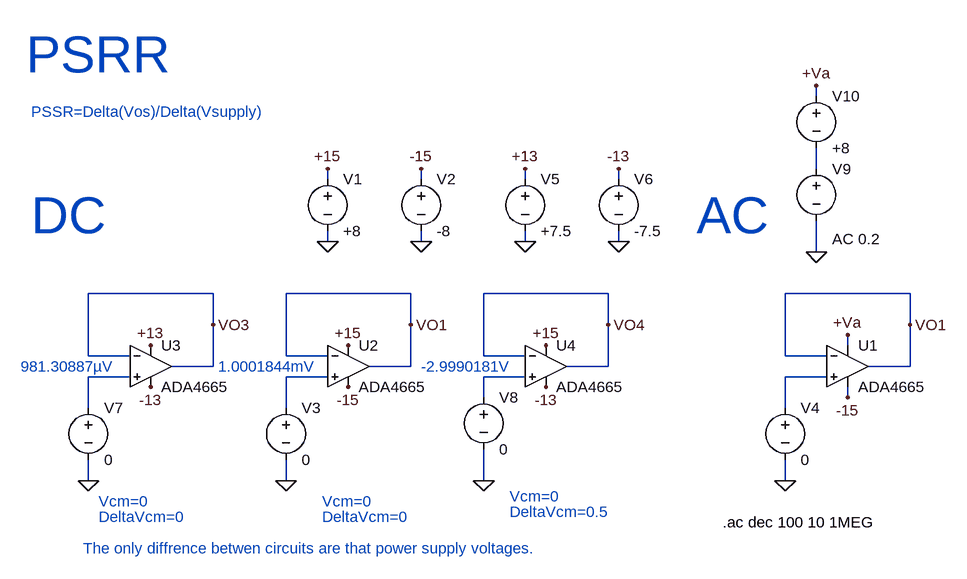
[diagram p0: schematic PSSR.asc]
PSSR.asc, the LTspice schematic file:
Version 4
SHEET 1 1664 680
WIRE 704 -80 704 -96
WIRE 704 32 704 0
WIRE -48 48 -48 32
WIRE 96 48 96 32
WIRE 256 48 256 32
WIRE 400 48 400 32
WIRE -48 144 -48 128
WIRE 96 144 96 128
WIRE 256 144 256 128
WIRE 400 144 400 128
WIRE 704 160 704 112
WIRE -224 224 -416 224
WIRE 80 224 -112 224
WIRE 384 224 192 224
WIRE 848 224 656 224
WIRE -224 272 -224 224
WIRE 80 272 80 224
WIRE 384 272 384 224
WIRE 848 272 848 224
WIRE 752 304 752 288
WIRE -416 320 -416 224
WIRE -352 320 -416 320
WIRE -112 320 -112 224
WIRE -48 320 -112 320
WIRE 192 320 192 224
WIRE 256 320 192 320
WIRE 656 320 656 224
WIRE 720 320 656 320
WIRE -224 336 -224 272
WIRE -224 336 -288 336
WIRE 80 336 80 272
WIRE 80 336 16 336
WIRE 384 336 384 272
WIRE 384 336 320 336
WIRE 848 336 848 272
WIRE 848 336 784 336
WIRE -352 352 -416 352
WIRE -48 352 -112 352
WIRE 256 352 192 352
WIRE 720 352 656 352
WIRE 192 384 192 352
WIRE 752 384 752 368
WIRE -416 400 -416 352
WIRE -112 400 -112 352
WIRE 656 400 656 352
WIRE -416 512 -416 480
WIRE -112 512 -112 480
WIRE 192 512 192 464
WIRE 656 512 656 480
FLAG -48 32 +15
FLAG -48 144 0
FLAG 96 144 0
FLAG 96 32 -15
FLAG -16 304 +15
FLAG -16 368 -15
FLAG -112 512 0
FLAG 80 272 VO1
FLAG 256 32 +13
FLAG 256 144 0
FLAG 400 144 0
FLAG 400 32 -13
FLAG -416 512 0
FLAG -224 272 VO3
FLAG -320 304 +13
FLAG -320 368 -13
FLAG 192 512 0
FLAG 384 272 VO4
FLAG 288 304 +15
FLAG 288 368 -13
FLAG 752 384 -15
FLAG 656 512 0
FLAG 848 272 VO1
FLAG 704 -96 +Va
FLAG 704 160 0
FLAG 752 288 +Va
SYMBOL voltage -48 32 R0
WINDOW 123 0 0 Left 0
WINDOW 39 0 0 Left 0
SYMATTR InstName V1
SYMATTR Value +8
SYMBOL voltage 96 32 R0
WINDOW 123 0 0 Left 0
WINDOW 39 0 0 Left 0
SYMATTR InstName V2
SYMATTR Value -8
SYMBOL voltage -112 384 R0
WINDOW 123 0 0 Left 0
WINDOW 39 0 0 Left 0
SYMATTR InstName V3
SYMATTR Value 0
SYMBOL voltage 256 32 R0
WINDOW 123 0 0 Left 0
WINDOW 39 0 0 Left 0
SYMATTR InstName V5
SYMATTR Value +7.5
SYMBOL voltage 400 32 R0
WINDOW 123 0 0 Left 0
WINDOW 39 0 0 Left 0
SYMATTR InstName V6
SYMATTR Value -7.5
SYMBOL voltage -416 384 R0
WINDOW 123 0 0 Left 0
WINDOW 39 0 0 Left 0
SYMATTR InstName V7
SYMATTR Value 0
SYMBOL Opamps\\ADA4665 -320 272 R0
SYMATTR InstName U3
SYMBOL Opamps\\ADA4665 -16 272 R0
SYMATTR InstName U2
SYMBOL voltage 192 368 R0
WINDOW 123 0 0 Left 0
WINDOW 39 0 0 Left 0
SYMATTR InstName V8
SYMATTR Value 0
SYMBOL Opamps\\ADA4665 288 272 R0
SYMATTR InstName U4
SYMBOL voltage 656 384 R0
WINDOW 123 0 0 Left 0
WINDOW 39 0 0 Left 0
SYMATTR InstName V4
SYMATTR Value 0
SYMBOL Opamps\\ADA4665 752 272 R0
SYMATTR InstName U1
SYMBOL voltage 704 16 R0
WINDOW 123 24 124 Left 2
WINDOW 39 0 0 Left 0
SYMATTR Value2 AC 0.2
SYMATTR InstName V9
SYMATTR Value ""
SYMBOL voltage 704 -96 R0
WINDOW 123 0 0 Left 0
WINDOW 39 0 0 Left 0
SYMATTR InstName V10
SYMATTR Value +8
TEXT 560 576 Left 2 !.ac dec 100 10 1MEG
TEXT -512 -144 Left 6 ;PSRR
TEXT -424 616 Left 2 ;The only diffrence betwen circuits are that power supply voltages.
TEXT -504 -56 Left 2 ;PSSR=Delta(Vos)/Delta(Vsupply)
TEXT -400 568 Left 2 ;DeltaVcm=0
TEXT -56 568 Left 2 ;DeltaVcm=0
TEXT 232 560 Left 2 ;DeltaVcm=0.5
TEXT -400 544 Left 2 ;Vcm=0
TEXT -56 544 Left 2 ;Vcm=0
TEXT 232 536 Left 2 ;Vcm=0
TEXT -520 336 Left 2 ;981.30887µV
TEXT -216 336 Left 2 ;1.0001844mV
TEXT 96 336 Left 2 ;-2.9990181V
TEXT -504 104 Left 6 ;DC
TEXT 520 104 Left 6 ;AC

The netlist it stands for:
* PSSR.asc
V1 +15 0 +8
V2 -15 0 -8
V3 N003 0 0
V5 +13 0 +7.5
V6 -13 0 -7.5
V7 N002 0 0
XU3 N002 VO3 +13 -13 VO3 ADA4665  ; pins In+ In- V+ V- OUT
XU2 N003 VO1 +15 -15 VO1 ADA4665  ; pins In+ In- V+ V- OUT
V8 N004 0 0
XU4 N004 VO4 +15 -13 VO4 ADA4665  ; pins In+ In- V+ V- OUT
V4 N005 0 0
XU1 N005 VO1 +Va -15 VO1 ADA4665  ; pins In+ In- V+ V- OUT
V9 N001 0 AC 0.2
V10 +Va N001 +8
.ac dec 100 10 1MEG
* PSRR
* The only diffrence betwen circuits are that power supply voltages.
* PSSR=Delta(Vos)/Delta(Vsupply)
* DeltaVcm=0
* DeltaVcm=0
* DeltaVcm=0.5
* Vcm=0
* Vcm=0
* Vcm=0
* 981.30887µV
* 1.0001844mV
* -2.9990181V
* DC
* AC
.backanno
.end